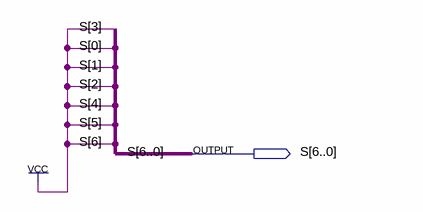
[diagram p0: schematic sheet]
// Quartus schematic zeradisplay.bdf as structural Verilog: 0 symbols, 1 pins
module zeradisplay (
  output [6:0] S
);


  assign S = {7{1'b1}};
endmodule
